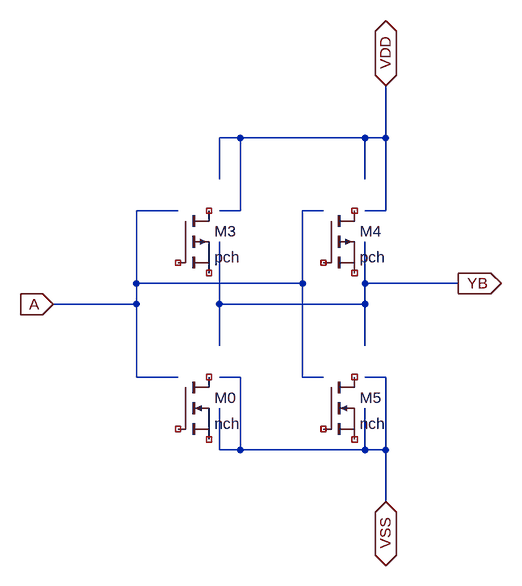
[diagram p0: schematic inv2.asc]
inv2.asc, the LTspice schematic file:
Version 4
SHEET 1 800 832
WIRE 224 544 224 432
WIRE 480 288 512 288
WIRE 480 544 512 544
WIRE 480 400 480 288
WIRE 224 400 480 400
WIRE 224 432 224 400
WIRE 480 544 480 400
WIRE 96 432 224 432
WIRE 224 288 288 288
WIRE 224 544 288 544
WIRE 224 400 224 288
WIRE 352 432 352 336
WIRE 576 432 576 400
WIRE 352 432 576 432
WIRE 576 400 576 336
WIRE 576 496 576 432
WIRE 576 400 720 400
WIRE 352 496 352 432
WIRE 384 656 576 656
WIRE 576 656 608 656
WIRE 608 656 608 544
WIRE 576 544 608 544
WIRE 576 656 576 592
WIRE 608 656 608 736
WIRE 352 656 384 656
WIRE 384 656 384 544
WIRE 352 544 384 544
WIRE 352 656 352 592
WIRE 384 176 576 176
WIRE 576 176 608 176
WIRE 608 288 608 176
WIRE 576 288 608 288
WIRE 576 240 576 176
WIRE 608 96 608 176
WIRE 352 176 384 176
WIRE 384 288 384 176
WIRE 352 288 384 288
WIRE 352 240 352 176
SYMBOL PMOS 512 288 R0
SYMATTR InstName M4
SYMATTR Value pch
SYMATTR Value2 w=6u l=1u
SYMBOL PMOS 288 288 R0
SYMATTR InstName M3
SYMATTR Value pch
SYMATTR Value2 w=6u l=1u
SYMBOL NMOS 512 544 R0
SYMATTR InstName M5
SYMATTR Value nch
SYMATTR Value2 w=2u l=1u
SYMBOL NMOS 288 544 R0
SYMATTR InstName M0
SYMATTR Value nch
SYMATTR Value2 w=2u l=1u
FLAG 720 400 YB
IOPIN 720 400 Out
FLAG 608 736 VSS
IOPIN 608 736 BiDir
FLAG 608 96 VDD
IOPIN 608 96 BiDir
FLAG 96 432 A
IOPIN 96 432 In

The netlist it stands for:
* inv2.asc
* M4: pch w=6u l=1u (symbol PMOS not certain, pin order unknown); nets seen at it: 
* M3: pch w=6u l=1u (symbol PMOS not certain, pin order unknown); nets seen at it: 
* M5: nch w=2u l=1u (symbol NMOS not certain, pin order unknown); nets seen at it: 
* M0: nch w=2u l=1u (symbol NMOS not certain, pin order unknown); nets seen at it: 
.backanno
.end